# Altium schematic sheet Input.SchDoc
size A4
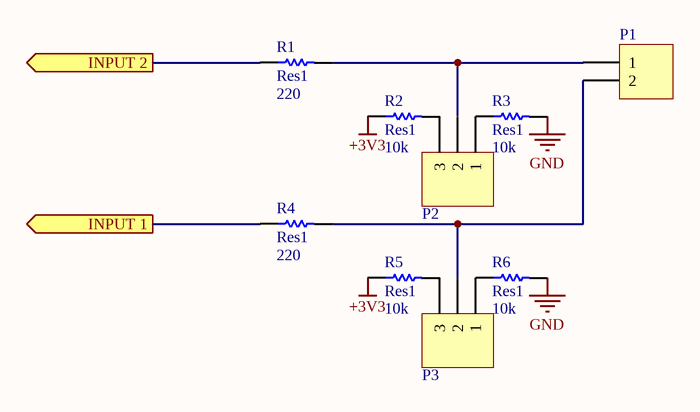
[diagram p0: Input.SchDoc]

## Parts
P1  Header 2  [2 PIN TERM BLK]  (value not drawn)
P2  Header 3  [HDR1X3]  (value not drawn)
P3  Header 3  [HDR1X3]  (value not drawn)
R1  Res1  value 220  [6-0805_N]
R2  Res1  value 10k  [6-0805_N]
R3  Res1  value 10k  [6-0805_N]
R4  Res1  value 220  [6-0805_N]
R5  Res1  value 10k  [6-0805_N]
R6  Res1  value 10k  [6-0805_N]

## Ports
INPUT 1 (out), INPUT 2 (out)

## Nets
+3V3: R2.1 R5.1
GND: R3.2 R6.2
INPUT 1: R4.1 ; port INPUT 1
INPUT 2: R1.1 ; port INPUT 2
NetP1_1: P1.1 P2.2 R1.2
NetP1_2: P1.2 P3.2 R4.2
NetP2_1: P2.1 R3.1
NetP2_3: P2.3 R2.2
NetP3_1: P3.1 R6.1
NetP3_3: P3.3 R5.2

## Library data of the parts
P1 = Header 2: Header, 2-Pin; LatestRevisionDate: 17-Jul-2002; LatestRevisionNote: Re-released for DXP Platform.; Publisher: Altium Limited
P2 P3 = Header 3: Header, 3-Pin; LatestRevisionDate: 17-Jul-2002; LatestRevisionNote: Re-released for DXP Platform.; Publisher: Altium Limited
R1-R6 = Res1: Resistor; Published: 8-Jun-2000; LatestRevisionDate: 17-Jul-2002; LatestRevisionNote: Re-released for DXP Platform.; PackageReference: AXIAL-0.3; Publisher: Altium Limited; PackageDescription: Axial Device, Thru-Hole; 2 Leads; 0.3 in Pin Spacing